# EAGLE schematic analog-io-breakout (EAGLE 8.3.2)
DESIGNER: JAKOB VOIGTS & JON NEWMAN; DESIGN_NAME: IO BOARD; LICENSE: CERN OHL v1.2; REVISION: 1.1
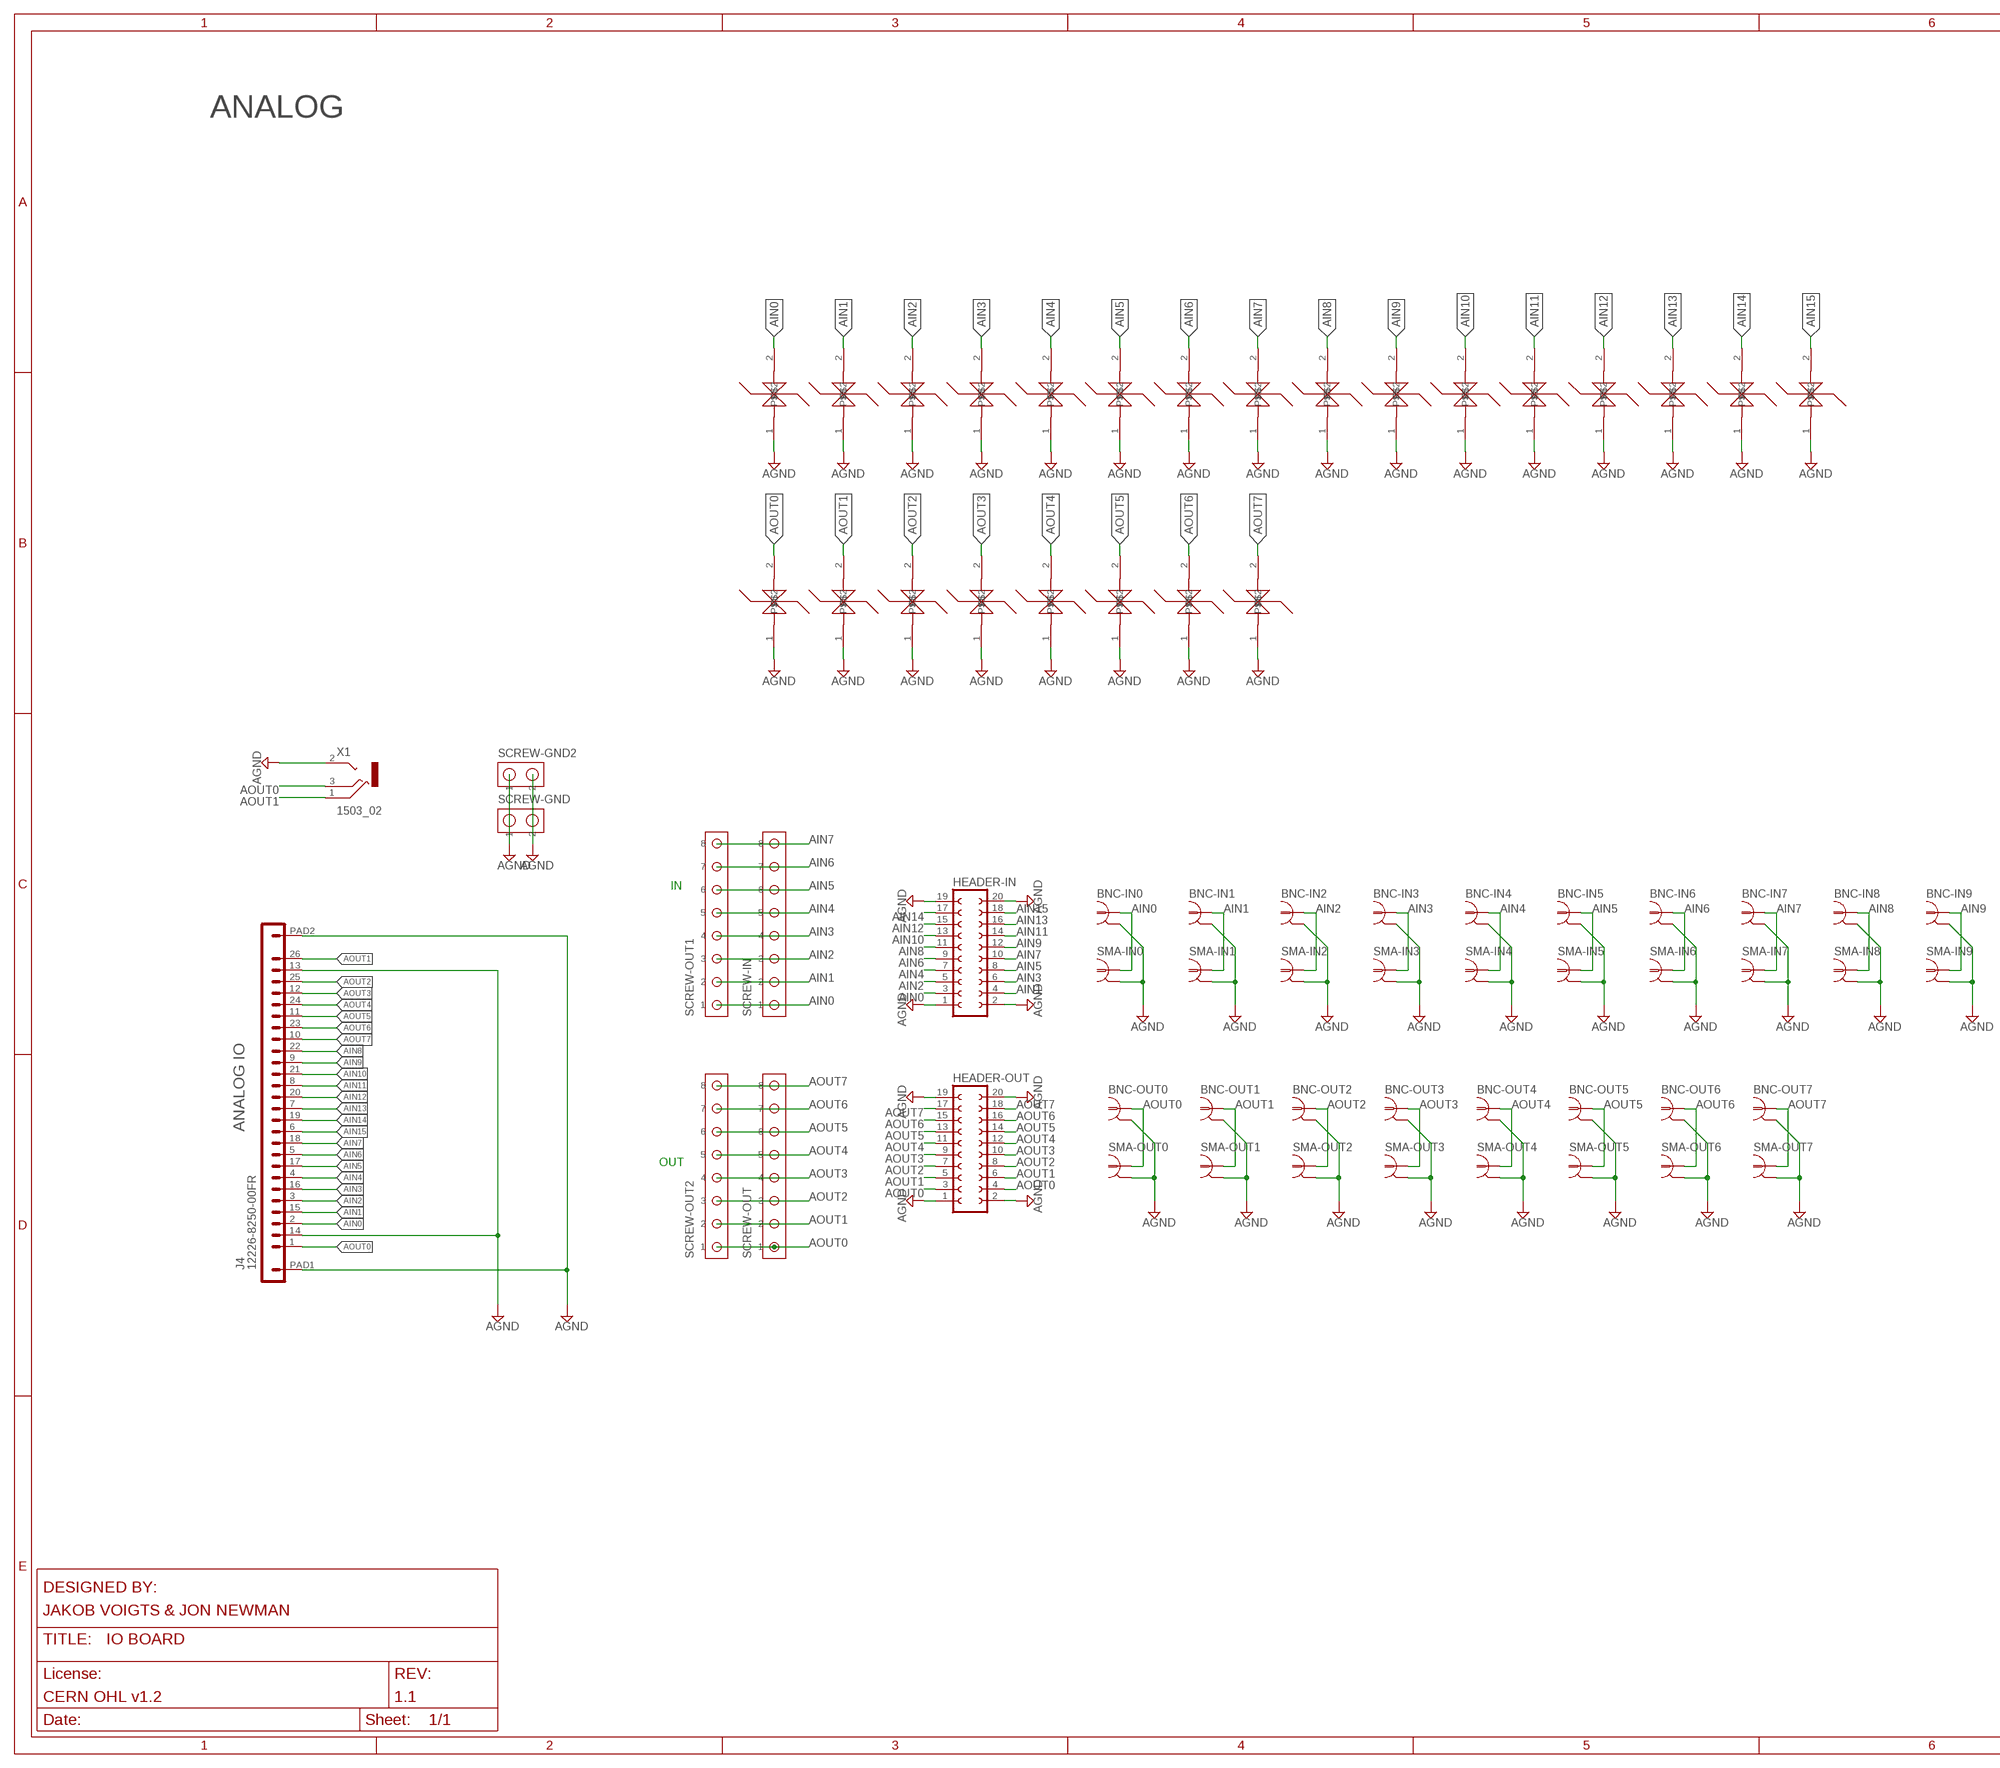
[diagram p0: schematic, sheet 1, part 1 of 2]
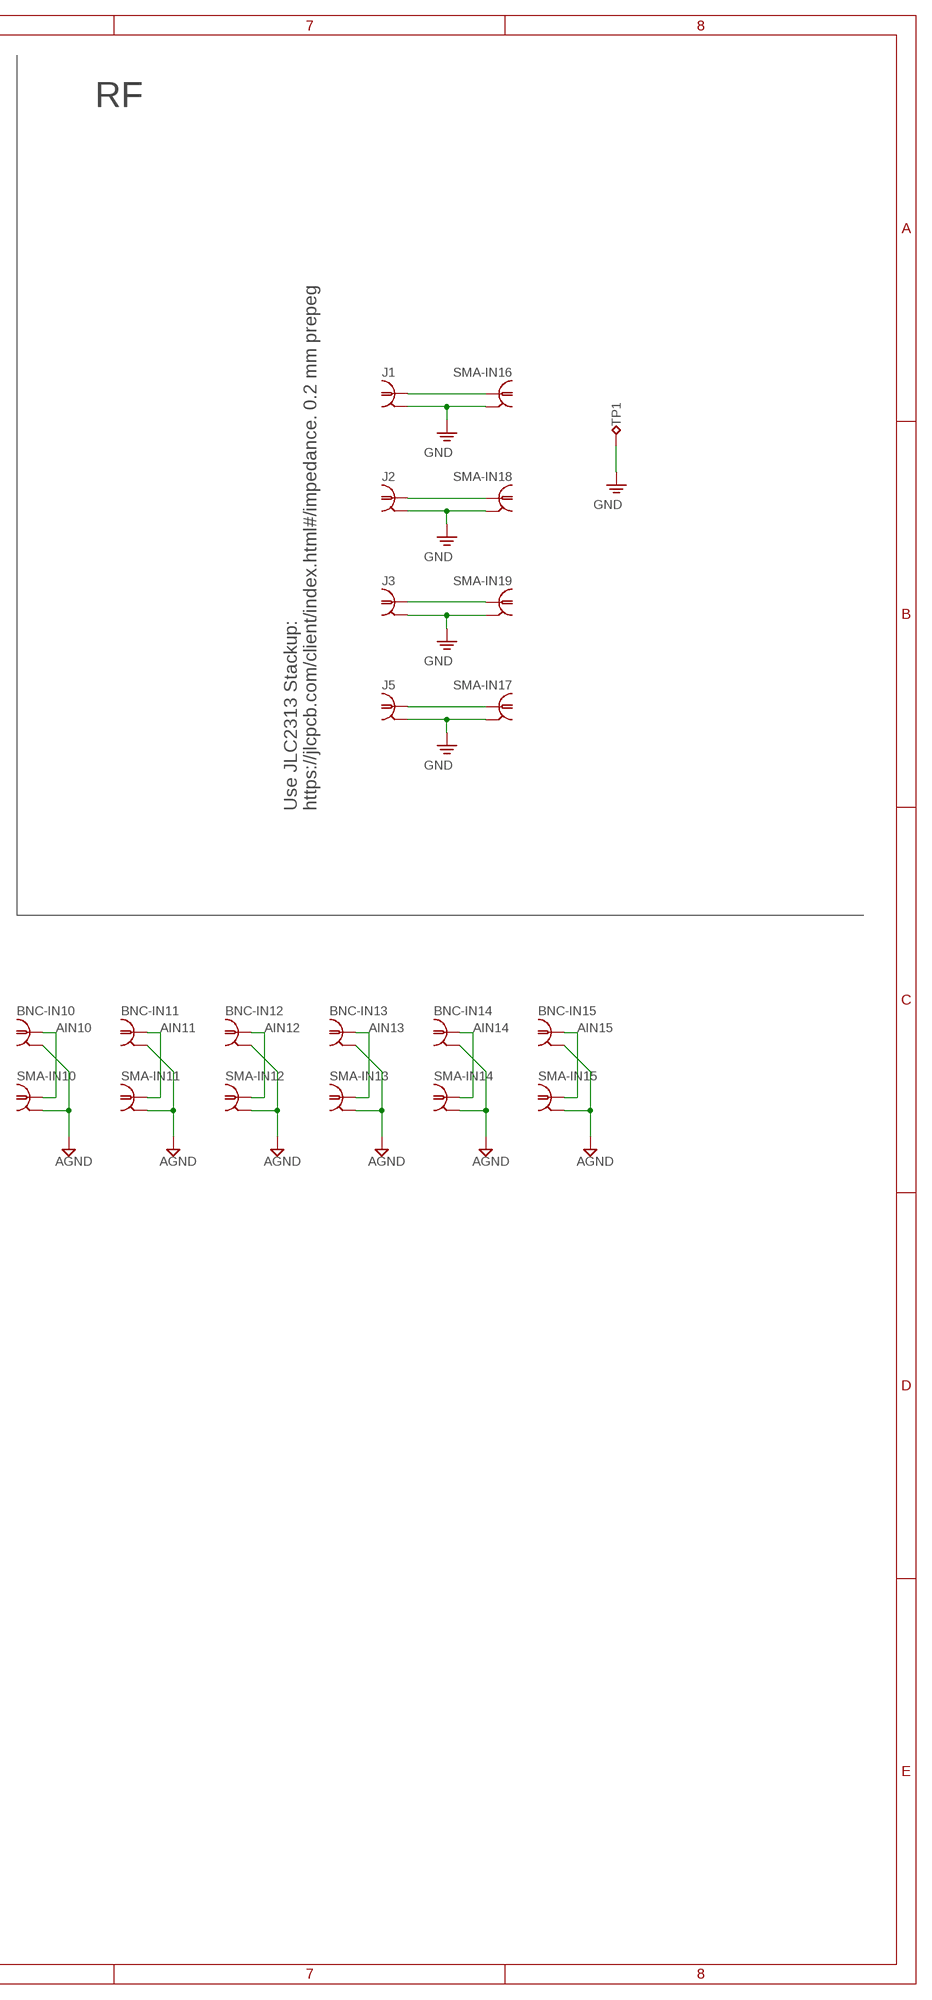
[diagram p1: schematic, sheet 1, part 2 of 2]

## Parts
BNC-IN0  COAX_B35N61-LARGE-HOLES  [B35N61_LARGE-HOLES]
BNC-IN1  COAX_B35N61-LARGE-HOLES  [B35N61_LARGE-HOLES]
BNC-IN2  COAX_B35N61-LARGE-HOLES  [B35N61_LARGE-HOLES]
BNC-IN3  COAX_B35N61-LARGE-HOLES  [B35N61_LARGE-HOLES]
BNC-IN4  COAX_B35N61-LARGE-HOLES  [B35N61_LARGE-HOLES]
BNC-IN5  COAX_B35N61-LARGE-HOLES  [B35N61_LARGE-HOLES]
BNC-IN6  COAX_B35N61-LARGE-HOLES  [B35N61_LARGE-HOLES]
BNC-IN7  COAX_B35N61-LARGE-HOLES  [B35N61_LARGE-HOLES]
BNC-IN8  COAX_B35N61-LARGE-HOLES  [B35N61_LARGE-HOLES]
BNC-IN9  COAX_B35N61-LARGE-HOLES  [B35N61_LARGE-HOLES]
BNC-IN10  COAX_B35N61-LARGE-HOLES  [B35N61_LARGE-HOLES]
BNC-IN11  COAX_B35N61-LARGE-HOLES  [B35N61_LARGE-HOLES]
BNC-IN12  COAX_B35N61-LARGE-HOLES  [B35N61_LARGE-HOLES]
BNC-IN13  COAX_B35N61-LARGE-HOLES  [B35N61_LARGE-HOLES]
BNC-IN14  COAX_B35N61-LARGE-HOLES  [B35N61_LARGE-HOLES]
BNC-IN15  COAX_B35N61-LARGE-HOLES  [B35N61_LARGE-HOLES]
BNC-OUT0  COAX_B35N61-LARGE-HOLES  [B35N61_LARGE-HOLES]
BNC-OUT1  COAX_B35N61-LARGE-HOLES  [B35N61_LARGE-HOLES]
BNC-OUT2  COAX_B35N61-LARGE-HOLES  [B35N61_LARGE-HOLES]
BNC-OUT3  COAX_B35N61-LARGE-HOLES  [B35N61_LARGE-HOLES]
BNC-OUT4  COAX_B35N61-LARGE-HOLES  [B35N61_LARGE-HOLES]
BNC-OUT5  COAX_B35N61-LARGE-HOLES  [B35N61_LARGE-HOLES]
BNC-OUT6  COAX_B35N61-LARGE-HOLES  [B35N61_LARGE-HOLES]
BNC-OUT7  COAX_B35N61-LARGE-HOLES  [B35N61_LARGE-HOLES]
HEADER-IN  FE10-2  [FE10-2]
HEADER-OUT  FE10-2  [FE10-2]
J1  COAX_MMCX-RA  [MMCX-J-P-X-RA-SM1]
J2  COAX_MMCX-RA  [MMCX-J-P-X-RA-SM1]
J3  COAX_MMCX-RA  [MMCX-J-P-X-RA-SM1]
J4  12226-8250-00FR  PINHD-1X26_122  [12226-82X0-00XX]
J5  COAX_MMCX-RA  [MMCX-J-P-X-RA-SM1]
SCREW-GND  SCREW2  [SCREW2]
SCREW-GND2  SCREW2  [SCREW2]
SCREW-IN  SCREW8  [SCREW8]
SCREW-OUT  SCREW8  [SCREW8]
SCREW-OUT1  SCREW8  [SCREW8]
SCREW-OUT2  SCREW8  [SCREW8]
SMA-IN0  COAX_SMA-VERT  [SMA_JACK_142-0701-201]
SMA-IN1  COAX_SMA-VERT  [SMA_JACK_142-0701-201]
SMA-IN2  COAX_SMA-VERT  [SMA_JACK_142-0701-201]
SMA-IN3  COAX_SMA-VERT  [SMA_JACK_142-0701-201]
SMA-IN4  COAX_SMA-VERT  [SMA_JACK_142-0701-201]
SMA-IN5  COAX_SMA-VERT  [SMA_JACK_142-0701-201]
SMA-IN6  COAX_SMA-VERT  [SMA_JACK_142-0701-201]
SMA-IN7  COAX_SMA-VERT  [SMA_JACK_142-0701-201]
SMA-IN8  COAX_SMA-VERT  [SMA_JACK_142-0701-201]
SMA-IN9  COAX_SMA-VERT  [SMA_JACK_142-0701-201]
SMA-IN10  COAX_SMA-VERT  [SMA_JACK_142-0701-201]
SMA-IN11  COAX_SMA-VERT  [SMA_JACK_142-0701-201]
SMA-IN12  COAX_SMA-VERT  [SMA_JACK_142-0701-201]
SMA-IN13  COAX_SMA-VERT  [SMA_JACK_142-0701-201]
SMA-IN14  COAX_SMA-VERT  [SMA_JACK_142-0701-201]
SMA-IN15  COAX_SMA-VERT  [SMA_JACK_142-0701-201]
SMA-IN16  COAX_SMA-VERT  [SMA_JACK_142-0701-201]
SMA-IN17  COAX_SMA-VERT  [SMA_JACK_142-0701-201]
SMA-IN18  COAX_SMA-VERT  [SMA_JACK_142-0701-201]
SMA-IN19  COAX_SMA-VERT  [SMA_JACK_142-0701-201]
SMA-OUT0  COAX_SMA-VERT  [SMA_JACK_142-0701-201]
SMA-OUT1  COAX_SMA-VERT  [SMA_JACK_142-0701-201]
SMA-OUT2  COAX_SMA-VERT  [SMA_JACK_142-0701-201]
SMA-OUT3  COAX_SMA-VERT  [SMA_JACK_142-0701-201]
SMA-OUT4  COAX_SMA-VERT  [SMA_JACK_142-0701-201]
SMA-OUT5  COAX_SMA-VERT  [SMA_JACK_142-0701-201]
SMA-OUT6  COAX_SMA-VERT  [SMA_JACK_142-0701-201]
SMA-OUT7  COAX_SMA-VERT  [SMA_JACK_142-0701-201]
TP1  TP_2MM  [TESTPOINT_2MM]
U$1  DIODE-ESD-BIDIRECTIONALDO-214AA  [DIOC7026X260]
U$2  DIODE-ESD-BIDIRECTIONALDO-214AA  [DIOC7026X260]
U$3  DIODE-ESD-BIDIRECTIONALDO-214AA  [DIOC7026X260]
U$4  DIODE-ESD-BIDIRECTIONALDO-214AA  [DIOC7026X260]
U$5  DIODE-ESD-BIDIRECTIONALDO-214AA  [DIOC7026X260]
U$6  DIODE-ESD-BIDIRECTIONALDO-214AA  [DIOC7026X260]
U$7  DIODE-ESD-BIDIRECTIONALDO-214AA  [DIOC7026X260]
U$8  DIODE-ESD-BIDIRECTIONALDO-214AA  [DIOC7026X260]
U$9  DIODE-ESD-BIDIRECTIONALDO-214AA  [DIOC7026X260]
U$10  DIODE-ESD-BIDIRECTIONALDO-214AA  [DIOC7026X260]
U$11  DIODE-ESD-BIDIRECTIONALDO-214AA  [DIOC7026X260]
U$12  DIODE-ESD-BIDIRECTIONALDO-214AA  [DIOC7026X260]
U$13  DIODE-ESD-BIDIRECTIONALDO-214AA  [DIOC7026X260]
U$14  DIODE-ESD-BIDIRECTIONALDO-214AA  [DIOC7026X260]
U$15  DIODE-ESD-BIDIRECTIONALDO-214AA  [DIOC7026X260]
U$16  DIODE-ESD-BIDIRECTIONALDO-214AA  [DIOC7026X260]
U$17  DIODE-ESD-BIDIRECTIONALDO-214AA  [DIOC7026X260]
U$18  DIODE-ESD-BIDIRECTIONALDO-214AA  [DIOC7026X260]
U$19  DIODE-ESD-BIDIRECTIONALDO-214AA  [DIOC7026X260]
U$20  DIODE-ESD-BIDIRECTIONALDO-214AA  [DIOC7026X260]
U$21  DIODE-ESD-BIDIRECTIONALDO-214AA  [DIOC7026X260]
U$22  DIODE-ESD-BIDIRECTIONALDO-214AA  [DIOC7026X260]
U$23  DIODE-ESD-BIDIRECTIONALDO-214AA  [DIOC7026X260]
U$24  DIODE-ESD-BIDIRECTIONALDO-214AA  [DIOC7026X260]
X1  1503_02  [1503_02]

## Nets
AGND: BNC-IN0.2 BNC-IN0.3 BNC-IN0.4 BNC-IN0.5 BNC-IN1.2 BNC-IN1.3 BNC-IN1.4 BNC-IN1.5 BNC-IN2.2 BNC-IN2.3 BNC-IN2.4 BNC-IN2.5 BNC-IN3.2 BNC-IN3.3 BNC-IN3.4 BNC-IN3.5 BNC-IN4.2 BNC-IN4.3 BNC-IN4.4 BNC-IN4.5 BNC-IN5.2 BNC-IN5.3 BNC-IN5.4 BNC-IN5.5 BNC-IN6.2 BNC-IN6.3 BNC-IN6.4 BNC-IN6.5 BNC-IN7.2 BNC-IN7.3 BNC-IN7.4 BNC-IN7.5 BNC-IN8.2 BNC-IN8.3 BNC-IN8.4 BNC-IN8.5 BNC-IN9.2 BNC-IN9.3 BNC-IN9.4 BNC-IN9.5 BNC-IN10.2 BNC-IN10.3 BNC-IN10.4 BNC-IN10.5 BNC-IN11.2 BNC-IN11.3 BNC-IN11.4 BNC-IN11.5 BNC-IN12.2 BNC-IN12.3 BNC-IN12.4 BNC-IN12.5 BNC-IN13.2 BNC-IN13.3 BNC-IN13.4 BNC-IN13.5 BNC-IN14.2 BNC-IN14.3 BNC-IN14.4 BNC-IN14.5 BNC-IN15.2 BNC-IN15.3 BNC-IN15.4 BNC-IN15.5 BNC-OUT0.2 BNC-OUT0.3 BNC-OUT0.4 BNC-OUT0.5 BNC-OUT1.2 BNC-OUT1.3 BNC-OUT1.4 BNC-OUT1.5 BNC-OUT2.2 BNC-OUT2.3 BNC-OUT2.4 BNC-OUT2.5 BNC-OUT3.2 BNC-OUT3.3 BNC-OUT3.4 BNC-OUT3.5 BNC-OUT4.2 BNC-OUT4.3 BNC-OUT4.4 BNC-OUT4.5 BNC-OUT5.2 BNC-OUT5.3 BNC-OUT5.4 BNC-OUT5.5 BNC-OUT6.2 BNC-OUT6.3 BNC-OUT6.4 BNC-OUT6.5 BNC-OUT7.2 BNC-OUT7.3 BNC-OUT7.4 BNC-OUT7.5 HEADER-IN.1 HEADER-IN.2 HEADER-IN.19 HEADER-IN.20 HEADER-OUT.1 HEADER-OUT.2 HEADER-OUT.19 HEADER-OUT.20 J4.13 J4.14 J4.PAD1 J4.PAD2 SCREW-GND2.P$1 SCREW-GND2.P$2 SCREW-GND.P$1 SCREW-GND.P$2 SMA-IN0.GND$1 SMA-IN0.GND$2 SMA-IN0.GND$3 SMA-IN0.GND$4 SMA-IN1.GND$1 SMA-IN1.GND$2 SMA-IN1.GND$3 SMA-IN1.GND$4 SMA-IN2.GND$1 SMA-IN2.GND$2 SMA-IN2.GND$3 SMA-IN2.GND$4 SMA-IN3.GND$1 SMA-IN3.GND$2 SMA-IN3.GND$3 SMA-IN3.GND$4 SMA-IN4.GND$1 SMA-IN4.GND$2 SMA-IN4.GND$3 SMA-IN4.GND$4 SMA-IN5.GND$1 SMA-IN5.GND$2 SMA-IN5.GND$3 SMA-IN5.GND$4 SMA-IN6.GND$1 SMA-IN6.GND$2 SMA-IN6.GND$3 SMA-IN6.GND$4 SMA-IN7.GND$1 SMA-IN7.GND$2 SMA-IN7.GND$3 SMA-IN7.GND$4 SMA-IN8.GND$1 SMA-IN8.GND$2 SMA-IN8.GND$3 SMA-IN8.GND$4 SMA-IN9.GND$1 SMA-IN9.GND$2 SMA-IN9.GND$3 SMA-IN9.GND$4 SMA-IN10.GND$1 SMA-IN10.GND$2 SMA-IN10.GND$3 SMA-IN10.GND$4 SMA-IN11.GND$1 SMA-IN11.GND$2 SMA-IN11.GND$3 SMA-IN11.GND$4 SMA-IN12.GND$1 SMA-IN12.GND$2 SMA-IN12.GND$3 SMA-IN12.GND$4 SMA-IN13.GND$1 SMA-IN13.GND$2 SMA-IN13.GND$3 SMA-IN13.GND$4 SMA-IN14.GND$1 SMA-IN14.GND$2 SMA-IN14.GND$3 SMA-IN14.GND$4 SMA-IN15.GND$1 SMA-IN15.GND$2 SMA-IN15.GND$3 SMA-IN15.GND$4 SMA-OUT0.GND$1 SMA-OUT0.GND$2 SMA-OUT0.GND$3 SMA-OUT0.GND$4 SMA-OUT1.GND$1 SMA-OUT1.GND$2 SMA-OUT1.GND$3 SMA-OUT1.GND$4 SMA-OUT2.GND$1 SMA-OUT2.GND$2 SMA-OUT2.GND$3 SMA-OUT2.GND$4 SMA-OUT3.GND$1 SMA-OUT3.GND$2 SMA-OUT3.GND$3 SMA-OUT3.GND$4 SMA-OUT4.GND$1 SMA-OUT4.GND$2 SMA-OUT4.GND$3 SMA-OUT4.GND$4 SMA-OUT5.GND$1 SMA-OUT5.GND$2 SMA-OUT5.GND$3 SMA-OUT5.GND$4 SMA-OUT6.GND$1 SMA-OUT6.GND$2 SMA-OUT6.GND$3 SMA-OUT6.GND$4 SMA-OUT7.GND$1 SMA-OUT7.GND$2 SMA-OUT7.GND$3 SMA-OUT7.GND$4 U$1.1 U$2.1 U$3.1 U$4.1 U$5.1 U$6.1 U$7.1 U$8.1 U$9.1 U$10.1 U$11.1 U$12.1 U$13.1 U$14.1 U$15.1 U$16.1 U$17.1 U$18.1 U$19.1 U$20.1 U$21.1 U$22.1 U$23.1 U$24.1 X1.2
AIN0: BNC-IN0.1 HEADER-IN.3 J4.2 SCREW-IN.1 SCREW-OUT1.1 SMA-IN0.CLK U$1.2
AIN1: BNC-IN1.1 HEADER-IN.4 J4.15 SCREW-IN.2 SCREW-OUT1.2 SMA-IN1.CLK U$2.2
AIN2: BNC-IN2.1 HEADER-IN.5 J4.3 SCREW-IN.3 SCREW-OUT1.3 SMA-IN2.CLK U$3.2
AIN3: BNC-IN3.1 HEADER-IN.6 J4.16 SCREW-IN.4 SCREW-OUT1.4 SMA-IN3.CLK U$4.2
AIN4: BNC-IN4.1 HEADER-IN.7 J4.4 SCREW-IN.5 SCREW-OUT1.5 SMA-IN4.CLK U$5.2
AIN5: BNC-IN5.1 HEADER-IN.8 J4.17 SCREW-IN.6 SCREW-OUT1.6 SMA-IN5.CLK U$6.2
AIN6: BNC-IN6.1 HEADER-IN.9 J4.5 SCREW-IN.7 SCREW-OUT1.7 SMA-IN6.CLK U$7.2
AIN7: BNC-IN7.1 HEADER-IN.10 J4.18 SCREW-IN.8 SCREW-OUT1.8 SMA-IN7.CLK U$8.2
AIN8: BNC-IN8.1 HEADER-IN.11 J4.22 SMA-IN8.CLK U$17.2
AIN9: BNC-IN9.1 HEADER-IN.12 J4.9 SMA-IN9.CLK U$18.2
AIN10: BNC-IN10.1 HEADER-IN.13 J4.21 SMA-IN10.CLK U$19.2
AIN11: BNC-IN11.1 HEADER-IN.14 J4.8 SMA-IN11.CLK U$20.2
AIN12: BNC-IN12.1 HEADER-IN.15 J4.20 SMA-IN12.CLK U$21.2
AIN13: BNC-IN13.1 HEADER-IN.16 J4.7 SMA-IN13.CLK U$22.2
AIN14: BNC-IN14.1 HEADER-IN.17 J4.19 SMA-IN14.CLK U$23.2
AIN15: BNC-IN15.1 HEADER-IN.18 J4.6 SMA-IN15.CLK U$24.2
AOUT0: BNC-OUT0.1 HEADER-OUT.3 HEADER-OUT.4 J4.1 SCREW-OUT2.1 SCREW-OUT.1 SMA-OUT0.CLK U$9.2 X1.3
AOUT1: BNC-OUT1.1 HEADER-OUT.5 HEADER-OUT.6 J4.26 SCREW-OUT2.2 SCREW-OUT.2 SMA-OUT1.CLK U$10.2 X1.1
AOUT2: BNC-OUT2.1 HEADER-OUT.7 HEADER-OUT.8 J4.25 SCREW-OUT2.3 SCREW-OUT.3 SMA-OUT2.CLK U$11.2
AOUT3: BNC-OUT3.1 HEADER-OUT.9 HEADER-OUT.10 J4.12 SCREW-OUT2.4 SCREW-OUT.4 SMA-OUT3.CLK U$12.2
AOUT4: BNC-OUT4.1 HEADER-OUT.11 HEADER-OUT.12 J4.24 SCREW-OUT2.5 SCREW-OUT.5 SMA-OUT4.CLK U$13.2
AOUT5: BNC-OUT5.1 HEADER-OUT.13 HEADER-OUT.14 J4.11 SCREW-OUT2.6 SCREW-OUT.6 SMA-OUT5.CLK U$14.2
AOUT6: BNC-OUT6.1 HEADER-OUT.15 HEADER-OUT.16 J4.23 SCREW-OUT2.7 SCREW-OUT.7 SMA-OUT6.CLK U$15.2
AOUT7: BNC-OUT7.1 HEADER-OUT.17 HEADER-OUT.18 J4.10 SCREW-OUT2.8 SCREW-OUT.8 SMA-OUT7.CLK U$16.2
GND: J1.2 J1.3 J1.4 J1.5 J2.2 J2.3 J2.4 J2.5 J3.2 J3.3 J3.4 J3.5 J5.2 J5.3 J5.4 J5.5 SMA-IN16.GND$1 SMA-IN16.GND$2 SMA-IN16.GND$3 SMA-IN16.GND$4 SMA-IN17.GND$1 SMA-IN17.GND$2 SMA-IN17.GND$3 SMA-IN17.GND$4 SMA-IN18.GND$1 SMA-IN18.GND$2 SMA-IN18.GND$3 SMA-IN18.GND$4 SMA-IN19.GND$1 SMA-IN19.GND$2 SMA-IN19.GND$3 SMA-IN19.GND$4 TP1.1(TP)
N$1: J1.1 SMA-IN16.CLK
N$3: J2.1 SMA-IN18.CLK
N$4: J3.1 SMA-IN19.CLK
N$5: J5.1 SMA-IN17.CLK
Unconnected: X1.2@2

## Notes on the sheet
- RF
- ANALOG
- Use JLC2313 Stackup: 
  https://jlcpcb.com/client/index.html#/impedance. 0.2 mm prepeg
- IN
- ANALOG IO
- OUT

## Library data of the parts
BNC-IN0 BNC-IN1-BNC-IN15 BNC-OUT0 BNC-OUT1-BNC-OUT7 J1-J3 J5 SMA-IN0 SMA-IN1-SMA-IN19 SMA-OUT0 SMA-OUT1-SMA-OUT7 = jonnew:COAX: COAX CONNECTOR - Edge mount BNC - Vertical BNC - Vertical SMA - etc
HEADER-IN HEADER-OUT = con-lsta:FE10-2: FEMALE HEADER; OC_FARNELL: unknown; OC_NEWARK: unknown
J4 = jonnew:PINHD-1X26
SCREW-GND SCREW-GND2 = jonnew:SCREW2: Screw Terminal
SCREW-IN SCREW-OUT SCREW-OUT1 SCREW-OUT2 = jonnew:SCREW8: Screw Terminal
TP1 = jonnew:TP: Test pad
U$1-U$24 = jonnew:DIODE-ESD-BIDIRECTIONAL
X1 = con-lumberg:1503_02: Jack connectors according to JISC 6560, 3.5 mm Klinkeneinbaukupplung nach JISC 6560, 3,5 mm, 3-polig/stereo, abgewinkelte Ausführung, Surface-Mount-Technik (SMT) Source: http://www.lumberg.com/Produkte/PDFs/1503_02.pdf; OC_FARNELL: 1216979; OC_NEWARK: unknown

## Net classes
1 diff: width 0.229 mm, drill 0.33 mm, clearance 0.127 mm